# Altium schematic sheet 车身411.schdoc
size 218 x 219 mm
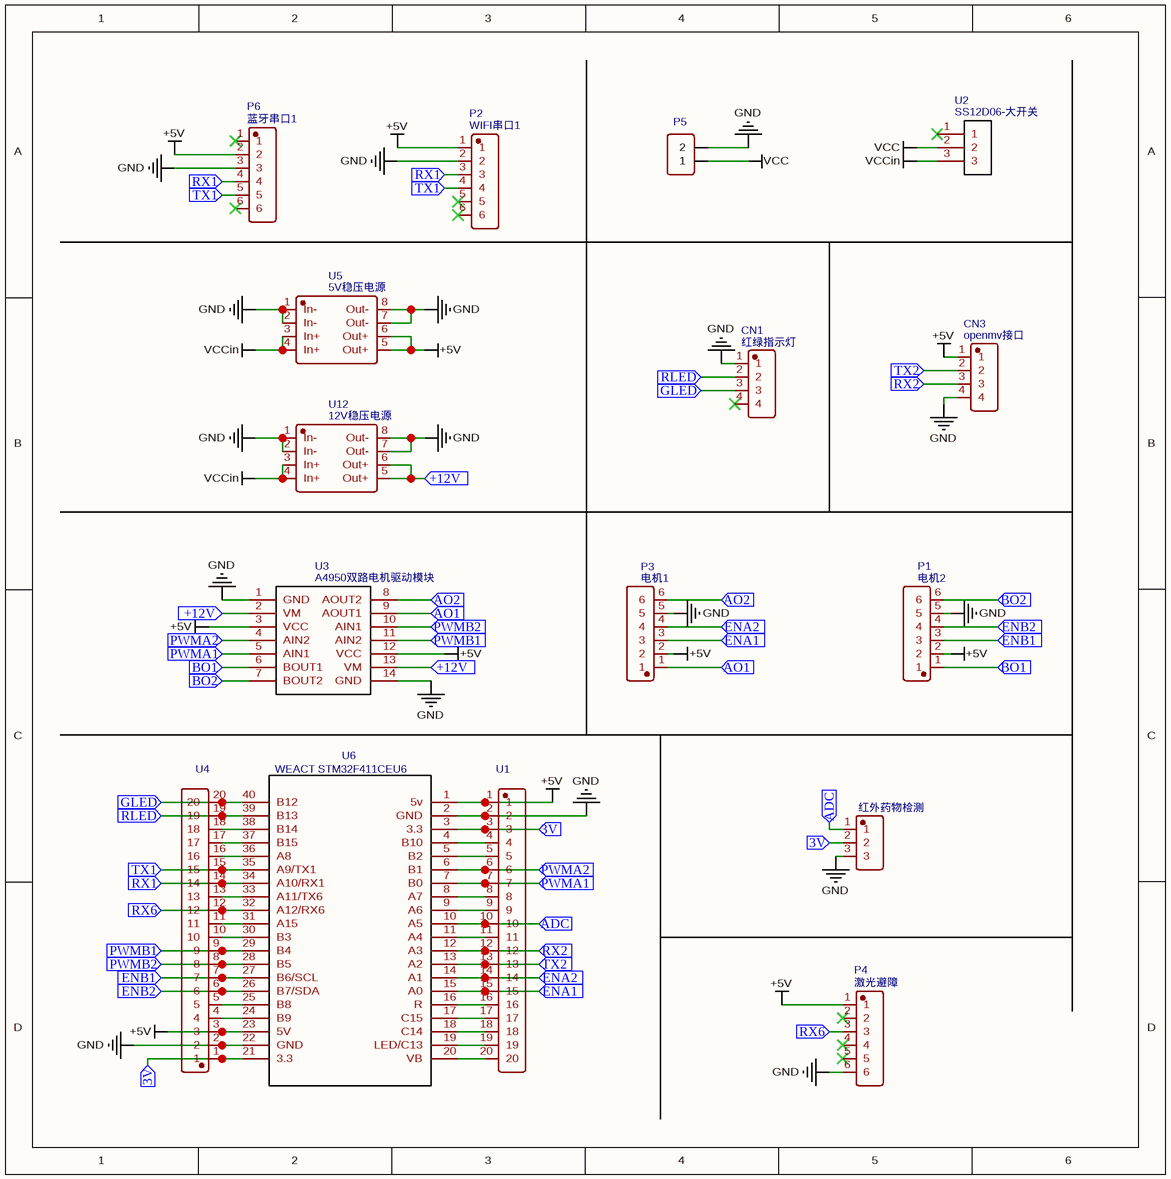
[diagram p0: 车身411.schdoc]

## Parts
1  红外药物检测  [HDR-TH_3P-P2.54-V-F]
CN1  红绿指示灯  [HDR-TH_4P-P2.54-V-F]
CN3  openmv接口  [HDR-TH_4P-P2.54-V-F]
P1  电机2  [HDR-TH_6P-P2.54-V-F]
P2  WIFI串口1  [HDR-TH_6P-P2.54-V-F]
P3  电机1  [HDR-TH_6P-P2.54-V-F]
P4  激光避障  [HDR-TH_6P-P2.54-V-F]
P5  Header-Female-2.54_1x2  [HDR-TH_2P-P2.54-V-F]  (value not drawn)
P6  蓝牙串口1  [HDR-TH_6P-P2.54-V-F]
U1  PM254-1-20-Z-8.5  [HDR-TH_20P-P2.54-V-F-2]  (value not drawn)
U2  SS12D06-大开关  [SS12D06开关]
U3  A4950双路电机驱动模块  [A4950双路电机驱动模块]
U4  PM254-1-20-Z-8.5  [HDR-TH_20P-P2.54-V-F-2]  (value not drawn)
U5  5V稳压电源  [DC-DC-AJ39]
U6  WEACT STM32F411CEU6  [WEACT STM32F411CEU6]
U12  12V稳压电源  [DC-DC-AJ39]

## Ports
3V (in), +12V (in), ADC (in), AO1 (in), AO2 (in), BO1 (in), BO2 (in), ENA1 (in), ENA2 (in), ENB1 (in), ENB2 (in), GLED (in), PWMA1 (in), PWMA2 (in), PWMB1 (in), PWMB2 (in), RLED (in), RX1 (in), RX2 (in), RX6 (in), TX1 (in), TX2 (in)

## Nets
+5V: CN3.1 P1.2 P2.1 P3.2 P4.1 P6.2 U1.1 U3.3(VCC) U3.12(VCC) U4.3 U5.5(Out+) U5.6(Out+) U6.1(5v) U6.23(5V)
GND: 1.3 CN1.1 CN3.4 P1.5 P2.2 P3.5 P4.6 P5.2 P6.3 U1.2 U3.1(GND) U3.14(GND) U4.2 U5.1(In-) U5.2(In-) U5.7(Out-) U5.8(Out-) U6.2(GND) U6.22(GND) U12.1(In-) U12.2(In-) U12.7(Out-) U12.8(Out-)
VCC: P5.1 U2.2
VCCin: U2.3 U5.3(In+) U5.4(In+) U12.3(In+) U12.4(In+)
3V: 1.2 U1.3 U4.1 U6.3(3.3) U6.21(3.3) ; port 3V
+12V: U3.2(VM) U3.13(VM) U12.5(Out+) U12.6(Out+) ; port +12V
ADC: 1.1 U1.10 U6.10(A5) ; port ADC
AO1: P3.1 U3.9(AOUT1) ; port AO1
AO2: P3.6 U3.8(AOUT2) ; port AO2
BO1: P1.1 U3.6(BOUT1) ; port BO1
BO2: P1.6 U3.7(BOUT2) ; port BO2
ENA1: P3.3 U1.15 U6.15(A0) ; port ENA1
ENA2: P3.4 U1.14 U6.14(A1) ; port ENA2
ENB1: P1.3 U4.7 U6.27(B6/SCL) ; port ENB1
ENB2: P1.4 U4.6 U6.26(B7/SDA) ; port ENB2
GLED: CN1.3 U4.20 U6.40(B12) ; port GLED
PWMA1: U1.7 U3.5(AIN1) U6.7(B0) ; port PWMA1
PWMA2: U1.6 U3.4(AIN2) U6.6(B1) ; port PWMA2
PWMB1: U3.11(AIN2) U4.9 U6.29(B4) ; port PWMB1
PWMB2: U3.10(AIN1) U4.8 U6.28(B5) ; port PWMB2
RLED: CN1.2 U4.19 U6.39(B13) ; port RLED
RX1: P2.3 P6.4 U4.14 U6.34(A10/RX1) ; port RX1
RX2: CN3.3 U1.12 U6.12(A3) ; port RX2
RX6: P4.3 U4.12 U6.32(A12/RX6) ; port RX6
TX1: P2.4 P6.5 U4.15 U6.35(A9/TX1) ; port TX1
TX2: CN3.2 U1.13 U6.13(A2) ; port TX2
NetU1_4: U1.4 U6.4(B10)
NetU1_5: U1.5 U6.5(B2)
NetU1_8: U1.8 U6.8(A7)
NetU1_9: U1.9 U6.9(A6)
NetU1_11: U1.11 U6.11(A4)
NetU1_16: U1.16 U6.16(R)
NetU1_17: U1.17 U6.17(C15)
NetU1_18: U1.18 U6.18(C14)
NetU1_19: U1.19 U6.19(LED/C13)
NetU1_20: U1.20 U6.20(VB)
NetU4_4: U4.4 U6.24(B9)
NetU4_5: U4.5 U6.25(B8)
NetU4_10: U4.10 U6.30(B3)
NetU4_11: U4.11 U6.31(A15)
NetU4_13: U4.13 U6.33(A11/TX6)
NetU4_16: U4.16 U6.36(A8)
NetU4_17: U4.17 U6.37(B15)
NetU4_18: U4.18 U6.38(B14)

Not connected (* = marked no-connect by the designer): CN1 4*; P2 5* 6*; P4 2* 4* 5*; P6 1* 6*; U2 1*

## Library data of the parts
1 = 红外药物检测: BOM_Manufacturer: null; BOM_Manufacturer Part: PinSocket_1x03_P2.54mm_Vertical; Contributor: LCSC; BOM_Supplier: LCSC; BOM_Supplier Part: C9900002703; LINK: https://img.jlc.com/pdf/applyPasteComponent/2021-11-29/208559D/b25eee3aee4e4e7ea894ac6be7827652/PM254-1x3.pdf; BOM_JLCPCB Part Class: Extended Part; spicePre: U; spiceSymbolName: PINSOCKET_1X03_P2.54MM_VERTICAL
CN1 = 红绿指示灯: BOM_Manufacturer: null; BOM_Manufacturer Part: JTAG; Contributor: LCSC; BOM_Supplier: LCSC; BOM_Supplier Part: C9900002996; BOM_JLCPCB Part Class: Extended Part; spicePre: C; spiceSymbolName: JTAG
CN3 = openmv接口: BOM_Manufacturer: null; BOM_Manufacturer Part: JTAG; Contributor: LCSC; BOM_Supplier: LCSC; BOM_Supplier Part: C9900002996; BOM_JLCPCB Part Class: Extended Part; spicePre: C; spiceSymbolName: JTAG
P1 = 电机2: BOM_Manufacturer: BOOMELE; BOM_Manufacturer Part: Female header 1*6p; BOM_Supplier: LCSC; BOM_Supplier Part: C40877; BOM_JLCPCB Part Class: Extended Part; spicePre: P; spiceSymbolName: Header-Female-2.54_1x6
P2 = WIFI串口1: BOM_Manufacturer: BOOMELE; BOM_Manufacturer Part: Female header 1*6p; BOM_Supplier: LCSC; BOM_Supplier Part: C40877; BOM_JLCPCB Part Class: Extended Part; spicePre: P; spiceSymbolName: Header-Female-2.54_1x6
P3 = 电机1: BOM_Manufacturer: BOOMELE; BOM_Manufacturer Part: Female header 1*6p; BOM_Supplier: LCSC; BOM_Supplier Part: C40877; BOM_JLCPCB Part Class: Extended Part; spicePre: P; spiceSymbolName: Header-Female-2.54_1x6
P4 = 激光避障: BOM_Manufacturer: BOOMELE; BOM_Manufacturer Part: Female header 1*6p; BOM_Supplier: LCSC; BOM_Supplier Part: C40877; BOM_JLCPCB Part Class: Extended Part; spicePre: P; spiceSymbolName: Header-Female-2.54_1x6
P5 = Header-Female-2.54_1x2: BOM_Manufacturer: BOOMELE; BOM_Manufacturer Part: 2.54-1*2PFemale; BOM_Supplier: LCSC; BOM_Supplier Part: C49661; BOM_JLCPCB Part Class: Extended Part; spicePre: P; spiceSymbolName: Header-Female-2.54_1x2
P6 = 蓝牙串口1: BOM_Manufacturer: BOOMELE; BOM_Manufacturer Part: Female header 1*6p; BOM_Supplier: LCSC; BOM_Supplier Part: C40877; BOM_JLCPCB Part Class: Extended Part; spicePre: P; spiceSymbolName: Header-Female-2.54_1x6
U1 U4 = PM254-1-20-Z-8.5: BOM_Manufacturer: HCTL(华灿天禄); Contributor: LCSC; BOM_Supplier: LCSC; BOM_Supplier Part: C2897383; BOM_Manufacturer Part: PM254-1-20-Z-8.5; BOM_JLCPCB Part Class: Extended Part; spicePre: U; spiceSymbolName: PM254-1-20-Z-8.5
U2 = SS12D06-大开关: Contributor: EDAERNaOH; spicePre: U; spiceSymbolName: SS12D06-大开关
U3 = A4950双路电机驱动模块: Contributor: youlikesoilove; spicePre: U; spiceSymbolName: A4950双路电机驱动模块
U5 = 5V稳压电源: BOM_Manufacturer: 深耕电子; Contributor: fu1fan; link: https://m.tb.cn/h.fMCzDL1?tk=ITIy2UshNVl; spicePre: U; spiceSymbolName: DC-DC AJ39
U6 = WEACT STM32F411CEU6: Contributor: LShang; BOM_Manufacturer: WEACT; spicePre: U; spiceSymbolName: WEACT STM32F411CEU6
U12 = 12V稳压电源: BOM_Manufacturer: 深耕电子; Contributor: fu1fan; link: https://m.tb.cn/h.fMCzDL1?tk=ITIy2UshNVl; spicePre: U; spiceSymbolName: DC-DC AJ39